# Altium schematic sheet Accelerometer and Gyro on Main Controller.SchDoc: Accelerometer and Gyro on Main Controller
size Letter
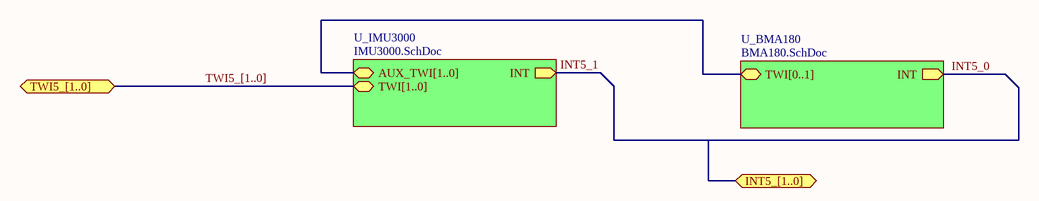
[diagram p0: Accelerometer and Gyro on Main Controller.SchDoc]

## Sub-sheets
U_BMA180 = BMA180.SchDoc: INT (out), TWI[0..1] (bidir)
U_IMU3000 = IMU3000.SchDoc: INT (out), AUX_TWI[1..0] (bidir), TWI[1..0] (bidir)

## Ports
INT5_[1..0], TWI5_[1..0]

## Nets
INT5_0: sheet U_BMA180/INT
INT5_1: sheet U_IMU3000/INT

## Buses and harness runs
bus sheet U_BMA180/TWI[0..1] = sheet U_IMU3000/AUX_TWI[1..0]
bus TWI5_[1..0] = port TWI5_[1..0] = sheet U_IMU3000/TWI[1..0]

## Notes on the sheet
- Title
- Size:
- Date:
- Letter
- Number:
- Time:
- Revision:
- Sheet
- of
- File: